# Altium schematic sheet MASTER.SchDoc
size A
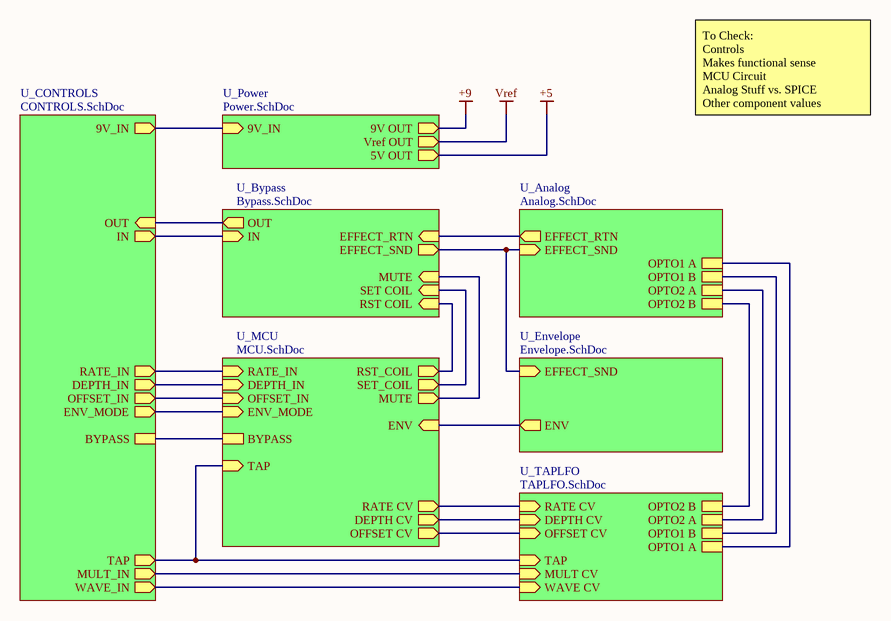
[diagram p0: MASTER.SchDoc]

## Sub-sheets
U_Analog = Analog.SchDoc: EFFECT_RTN (out), EFFECT_SND (in), OPTO1 A, OPTO1 B, OPTO2 A, OPTO2 B
U_Bypass = Bypass.SchDoc: EFFECT_RTN (in), IN (in), OUT (out), EFFECT_SND (out), MUTE (in), RST COIL (in), SET COIL (in)
U_CONTROLS = CONTROLS.SchDoc: RATE_IN (out), DEPTH_IN (out), OFFSET_IN (out), MULT_IN (out), IN (out), OUT (in), WAVE_IN (out), TAP (out), 9V_IN (out), BYPASS, ENV_MODE (out)
U_Envelope = Envelope.SchDoc: EFFECT_SND (in), ENV (out)
U_MCU = MCU.SchDoc: RATE_IN (in), OFFSET_IN (in), RATE CV (out), DEPTH CV (out), OFFSET CV (out), TAP (in), MUTE (out), SET_COIL (out), RST_COIL (out), BYPASS, ENV (in), DEPTH_IN (in), ENV_MODE (in)
U_Power = Power.SchDoc: 9V_IN (in), Vref OUT (out), 9V OUT (out), 5V OUT (out)
U_TAPLFO = TAPLFO.SchDoc: RATE CV (in), WAVE CV (in), MULT CV (in), DEPTH CV (in), OFFSET CV (in), TAP (in), OPTO1 A, OPTO1 B, OPTO2 A, OPTO2 B

## Nets
+5: sheet U_Power/5V OUT
+9: sheet U_Power/9V OUT
Vref: sheet U_Power/Vref OUT
(unnamed): sheet U_Analog/EFFECT_RTN, sheet U_Bypass/EFFECT_RTN
(unnamed): sheet U_Analog/EFFECT_SND, sheet U_Bypass/EFFECT_SND, sheet U_Envelope/EFFECT_SND
(unnamed): sheet U_Analog/OPTO1 A, sheet U_TAPLFO/OPTO1 A
(unnamed): sheet U_Analog/OPTO1 B, sheet U_TAPLFO/OPTO1 B
(unnamed): sheet U_Analog/OPTO2 A, sheet U_TAPLFO/OPTO2 A
(unnamed): sheet U_Analog/OPTO2 B, sheet U_TAPLFO/OPTO2 B
(unnamed): sheet U_Bypass/IN, sheet U_CONTROLS/IN
(unnamed): sheet U_Bypass/OUT, sheet U_CONTROLS/OUT
(unnamed): sheet U_Bypass/MUTE, sheet U_MCU/MUTE
(unnamed): sheet U_Bypass/RST COIL, sheet U_MCU/RST_COIL
(unnamed): sheet U_Bypass/SET COIL, sheet U_MCU/SET_COIL
(unnamed): sheet U_CONTROLS/RATE_IN, sheet U_MCU/RATE_IN
(unnamed): sheet U_CONTROLS/DEPTH_IN, sheet U_MCU/DEPTH_IN
(unnamed): sheet U_CONTROLS/OFFSET_IN, sheet U_MCU/OFFSET_IN
(unnamed): sheet U_CONTROLS/MULT_IN, sheet U_TAPLFO/MULT CV
(unnamed): sheet U_CONTROLS/WAVE_IN, sheet U_TAPLFO/WAVE CV
(unnamed): sheet U_CONTROLS/TAP, sheet U_MCU/TAP, sheet U_TAPLFO/TAP
(unnamed): sheet U_CONTROLS/9V_IN, sheet U_Power/9V_IN
(unnamed): sheet U_CONTROLS/BYPASS, sheet U_MCU/BYPASS
(unnamed): sheet U_CONTROLS/ENV_MODE, sheet U_MCU/ENV_MODE
(unnamed): sheet U_MCU/RATE CV, sheet U_TAPLFO/RATE CV
(unnamed): sheet U_MCU/DEPTH CV, sheet U_TAPLFO/DEPTH CV
(unnamed): sheet U_MCU/OFFSET CV, sheet U_TAPLFO/OFFSET CV
(unnamed): sheet U_MCU/ENV, sheet U_Envelope/ENV

## Notes on the sheet
- To Check:
  Controls
  Makes functional sense
  MCU Circuit
  Analog Stuff vs. SPICE
  Other component values